# Altium schematic sheet 23.SchDoc
size 513 x 386 mm
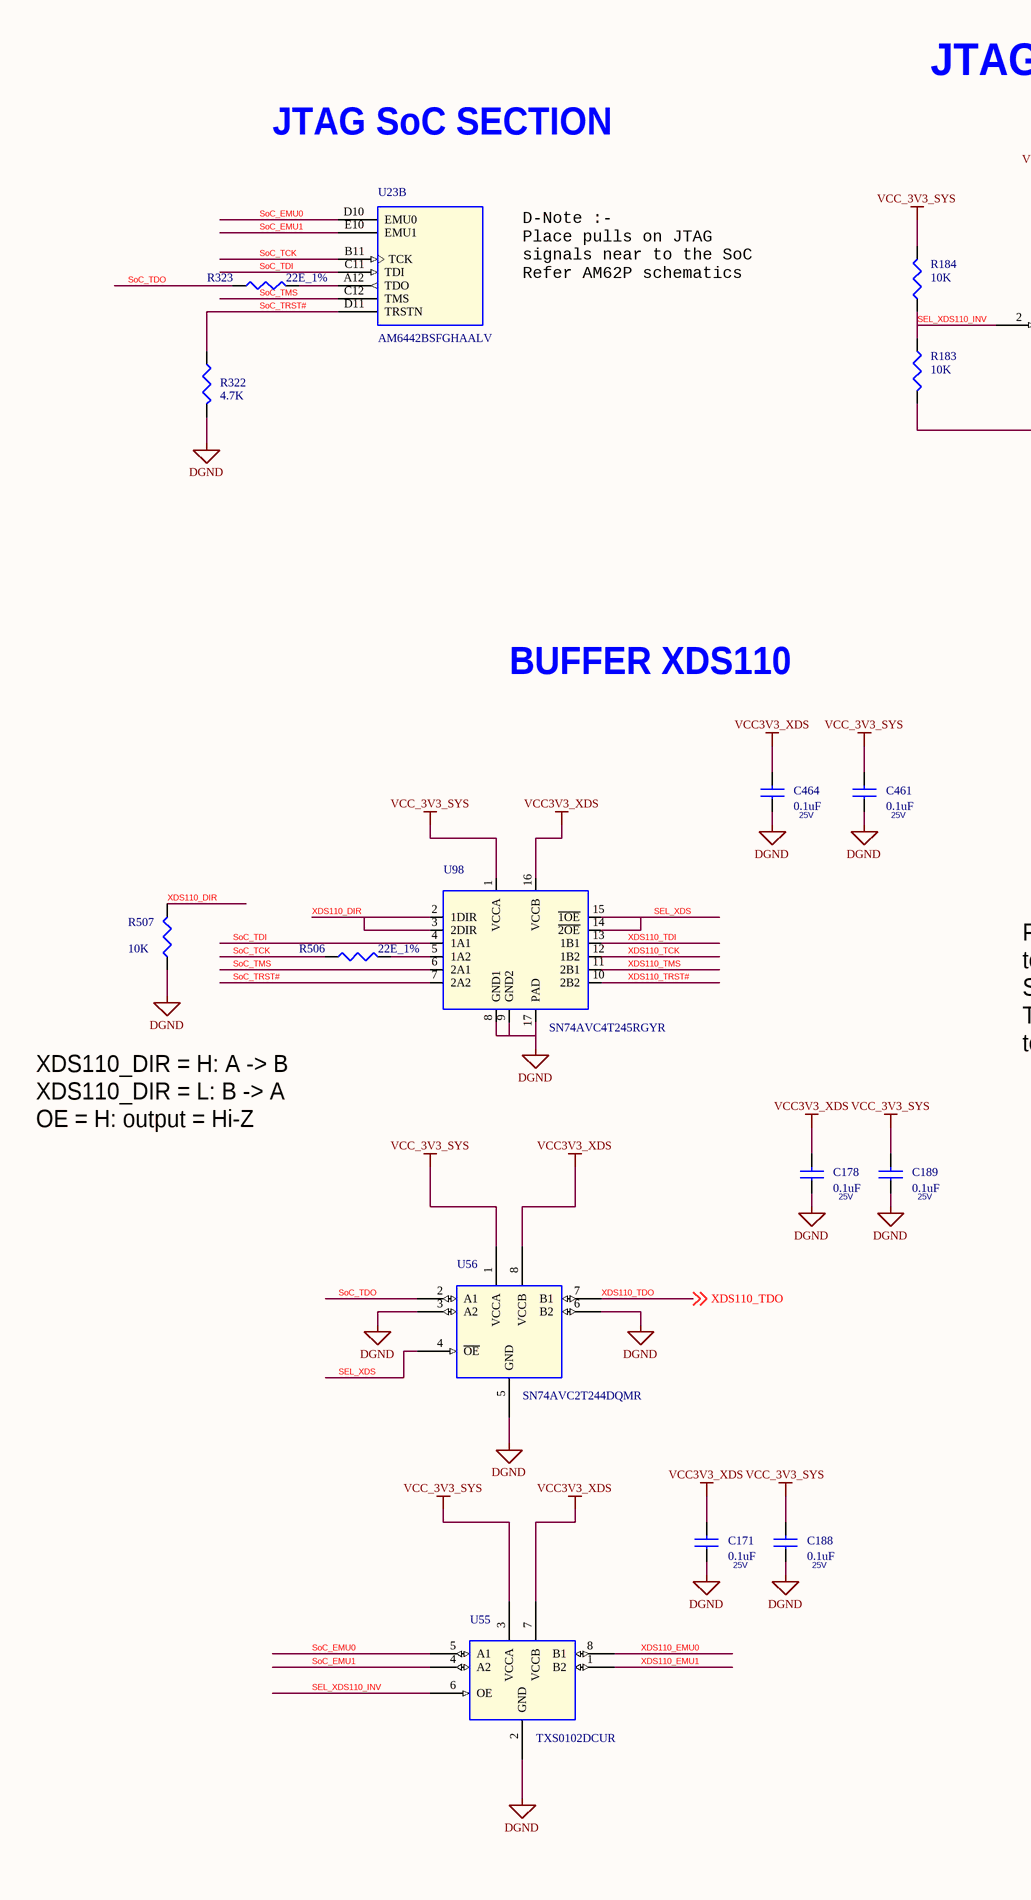
[diagram p0: 23.SchDoc, left]
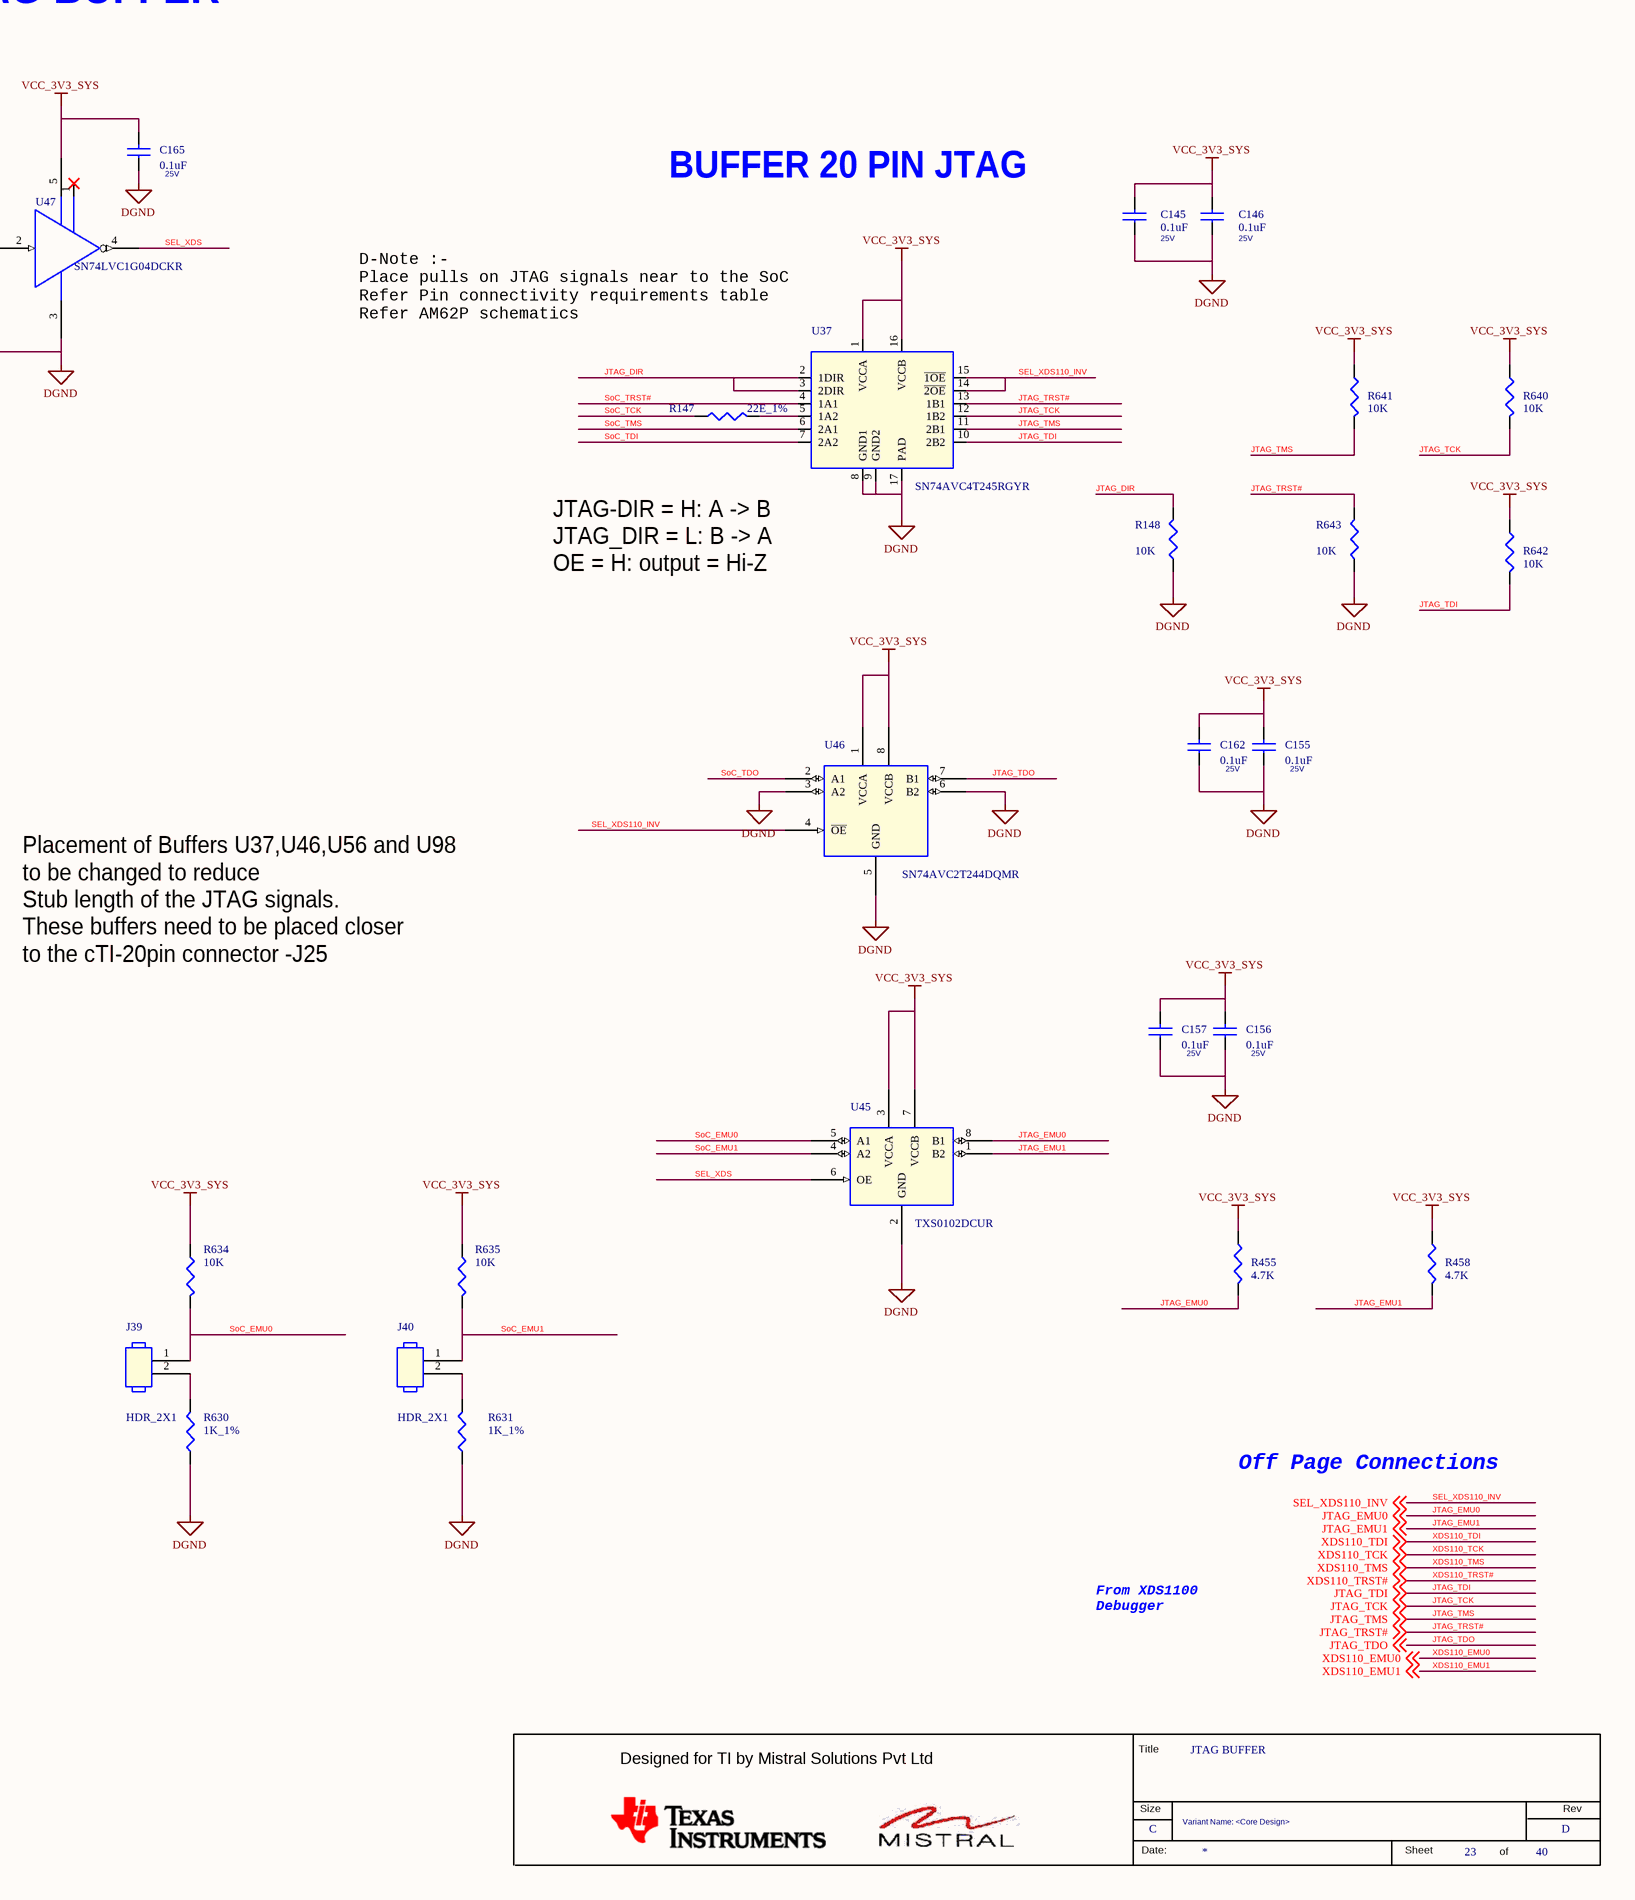
[diagram p1: 23.SchDoc, right]

## Parts
*  RevCode: D  Title: JTAG BUFFER  Page Size: C  Page Number: 23  Page Count: 40  Variant Name: <Core Design>  (hidden comment: MISTRAL_TITLEBLK_CSIZE)  (graphical)
C145  0.1uF  Voltage: 25V  [CAP0402_0-75]
C146  0.1uF  Voltage: 25V  [CAP0402_0-75]
C155  0.1uF  Voltage: 25V  [CAP0402_0-75]
C156  0.1uF  Voltage: 25V  [CAP0402_0-75]
C157  0.1uF  Voltage: 25V  [CAP0402_0-75]
C162  0.1uF  Voltage: 25V  [CAP0402_0-75]
C165  0.1uF  Voltage: 25V  [CAP0402_0-75]
C171  0.1uF  Voltage: 25V  [CAP0402_0-75]
C178  0.1uF  Voltage: 25V  [CAP0402_0-75]
C188  0.1uF  Voltage: 25V  [CAP0402_0-75]
C189  0.1uF  Voltage: 25V  [CAP0402_0-75]
C461  0.1uF  Voltage: 25V  [CAP0402_0-75]
C464  0.1uF  Voltage: 25V  [CAP0402_0-75]
J39  HDR_2X1  [HDR_2X1_100_S_T_10-8]
J40  HDR_2X1  [HDR_2X1_100_S_T_10-8]
R147  22E_1%  [RES0402_0-5]
R148  10K  [RES0402_0-5]
R183  10K  [RES0402_0-5]
R184  10K  [RES0402_0-5]
R322  4.7K  [RES0402_0-5]
R323  22E_1%  [RES0402_0-5]
R455  4.7K  [RES0402_0-5]
R458  4.7K  [RES0402_0-5]
R506  22E_1%  [RES0402_0-5]
R507  10K  [RES0402_0-5]
R630  1K_1%  [RES0402_0-5]
R631  1K_1%  [RES0402_0-5]
R634  10K  [RES0402_0-5]
R635  10K  [RES0402_0-5]
R640  10K  [RES0402_0-5]
R641  10K  [RES0402_0-5]
R642  10K  [RES0402_0-5]
R643  10K  [RES0402_0-5]
U23  AM6442BSFGHAALV  [FCBGA441_31-49_680X680_2-6]  (part B of 16)
U37  SN74AVC4T245RGYR  [QFN16_19-68_160X140]
U45  TXS0102DCUR  [VSSOP8_19-68_85X95_0-9]
U46  SN74AVC2T244DQMR  [X2SON8_15-74_70X50]
U47  SN74LVC1G04DCKR  [SC70-5]
U55  TXS0102DCUR  [VSSOP8_19-68_85X95_0-9]
U56  SN74AVC2T244DQMR  [X2SON8_15-74_70X50]
U98  SN74AVC4T245RGYR  [QFN16_19-68_160X140]

## Nets
DGND: C145.1 C146.1 C155.1 C156.1 C157.1 C162.1 C165.1 C171.1 C178.1 C188.1 C189.1 C461.1 C464.1 R148.1 R183.2 R322.2 R507.1 R630.1 R631.1 R643.1 U37.8(GND1) U37.9(GND2) U37.17(PAD) U45.2(GND) U46.3(A2) U46.5(GND) U46.6(B2) U47.3(GND) U55.2(GND) U56.3(A2) U56.5(GND) U56.6(B2) U98.8(GND1) U98.9(GND2) U98.17(PAD)
VCC3V3_XDS: C171.2 C178.2 C464.2 U55.7(VCCB) U56.8(VCCB) U98.16(VCCB)
VCC_3V3_SYS: C145.2 C146.2 C155.2 C156.2 C157.2 C162.2 C165.2 C188.2 C189.2 C461.2 R184.2 R455.1 R458.1 R634.1 R635.1 R640.1 R641.1 R642.1 U37.1(VCCA) U37.16(VCCB) U45.3(VCCA) U45.7(VCCB) U46.1(VCCA) U46.8(VCCB) U47.5(VCC) U55.3(VCCA) U56.1(VCCA) U98.1(VCCA)
JTAG_DIR: R148.2 U37.2(1DIR) U37.3(2DIR)
JTAG_EMU0: R455.2 U45.8(B1) ; off-sheet JTAG_EMU0
JTAG_EMU1: R458.2 U45.1(B2) ; off-sheet JTAG_EMU1
JTAG_TCK: R640.2 U37.12(1B2) ; off-sheet JTAG_TCK
JTAG_TDI: R642.2 U37.10(2B2) ; off-sheet JTAG_TDI
JTAG_TDO: U46.7(B1) ; off-sheet JTAG_TDO
JTAG_TMS: R641.2 U37.11(2B1) ; off-sheet JTAG_TMS
JTAG_TRST#: R643.2 U37.13(1B1) ; off-sheet JTAG_TRST#
SEL_XDS: U45.6(OE) U47.4(Y) U56.4(~{OE}) U98.14(~{2OE}) U98.15(~{1OE})
SEL_XDS110_INV: R183.1 R184.1 U37.14(~{2OE}) U37.15(~{1OE}) U46.4(~{OE}) U47.2(A) U55.6(OE) ; off-sheet SEL_XDS110_INV
SoC_EMU0: J39.1 R634.2 U23.D10(EMU0) U45.5(A1) U55.5(A1)
SoC_EMU1: J40.1 R635.2 U23.E10(EMU1) U45.4(A2) U55.4(A2)
SoC_TCK: R147.2 R506.2 U23.B11(TCK)
SoC_TDI: U23.C11(TDI) U37.7(2A2) U98.4(1A1)
SoC_TDO: R323.1 U46.2(A1) U56.2(A1)
SoC_TMS: U23.C12(TMS) U37.6(2A1) U98.6(2A1)
SoC_TRST#: R322.1 U23.D11(TRSTN) U37.4(1A1) U98.7(2A2)
XDS110_DIR: R507.2 U98.2(1DIR) U98.3(2DIR)
XDS110_EMU0: U55.8(B1) ; off-sheet XDS110_EMU0
XDS110_EMU1: U55.1(B2) ; off-sheet XDS110_EMU1
XDS110_TCK: U98.12(1B2) ; off-sheet XDS110_TCK
XDS110_TDI: U98.13(1B1) ; off-sheet XDS110_TDI
XDS110_TDO: U56.7(B1) ; off-sheet XDS110_TDO
XDS110_TMS: U98.11(2B1) ; off-sheet XDS110_TMS
XDS110_TRST#: U98.10(2B2) ; off-sheet XDS110_TRST#
NetJ39_2: J39.2 R630.2
NetJ40_2: J40.2 R631.2
NetR147_1: R147.1 U37.5(1A2)
NetR323_2: R323.2 U23.A12(TDO)
NetR506_1: R506.1 U98.5(1A2)

Not connected (* = marked no-connect by the designer): U47 1(NC)*

## Notes on the sheet
- JTAG BUFFER
- JTAG SoC SECTION
- D-Note :-
  Place pulls on JTAG
  signals near to the SoC
  Refer AM62P schematics
- BUFFER 20 PIN JTAG
- (near U37) D-Note :-
  Place pulls on JTAG signals near to the SoC
  Refer Pin connectivity requirements table
  Refer AM62P schematics
- (near U37) JTAG-DIR = H: A -> B
  JTAG_DIR = L: B -> A
  OE = H: output = Hi-Z
- BUFFER XDS110
- Placement of Buffers U37,U46,U56 and U98
  to be changed to reduce
  Stub length of the JTAG signals.
  These buffers need to be placed closer
  to the cTI-20pin connector -J25
- XDS110_DIR = H: A -> B
  XDS110_DIR = L: B -> A
  OE = H: output = Hi-Z
- Off Page Connections
- From XDS1100
  Debugger
- (in symbol MISTRAL_TITLEBLK_CSIZE) Title; Designed for TI by Mistral Solutions Pvt Ltd; Size; Rev; Date:; Sheet; of

## Library data of the parts
* = MISTRAL_TITLEBLK_CSIZE: Issue: 1.0; Page Create Date: March  8, 1995; Page Modify Date: *
C145 C146 C155 C156 C171 C178 C188 C189 C461 C464 = CAP_Dup3: CAP CERAMIC 0.1uF 25V 20% X5R 0402; Alt_Mfr_part_number: CC0402KRX5R8BB104; Mistral Part No: 120020080003-R; Mfr_name: WURTH ELECTRONICS; Mfr_part_number: 885012105018; Part_type: CAPACITORS\CERAMIC; Alt_Mfr_name: YAGEO AMERICA; Project: AM64x_EVM_BRD; Wattage: NA; Customs_HS_Code: 85322990; Custom_Duty: 15%; Tolerance: 20%; Package: 0402; Distributor_name: DIGIKEY; Distributor_part_number: 732-7495-1-ND; Height: 0.55MM; Weight: 0.65mg; Temperature: -55癈+85癈; Datasheet: Y:\MIS_DATABASE\DATASHEETS\CAPACITORS\885012105018.PDF; Crtd /date: ALVY/170820; Chkd/date: MANIRAJA/170820; MECHANICAL 3D STEP FILE: CAP0402_0-75; Library Ref: CAP; Footprint Ref: CAP0402_0-75; Library Path: Y:\MIS_DATABASE\Library\ALTIUM_TOOL\SCHEMATICS_PARTS\MS_DISCRETE_Library.schlib; Footprint Path: Y:\MIS_DATABASE\Library\ALTIUM_TOOL\PCB_FOOTPRINTS\Altium_Footprint_Lib.PcbLib; PCB Footprint: CAP0402_0-75
C157 C162 C165 = CAP_Dup3: CAP CERAMIC 0.1uF 25V 20% X5R 0402; Alt_Mfr_name: YAGEO AMERICA; Part_type: CAPACITORS\CERAMIC; Mfr_part_number: 885012105018; Mfr_name: WURTH ELECTRONICS; Mistral Part No: 120020080003-R; Alt_Mfr_part_number: CC0402KRX5R8BB104; Custom_Duty: 15%; Customs_HS_Code: 85322990; Wattage: NA; Project: AM64x_EVM_BRD; Footprint Path: Y:\MIS_DATABASE\Library\ALTIUM_TOOL\PCB_FOOTPRINTS\Altium_Footprint_Lib.PcbLib; Library Path: Y:\MIS_DATABASE\Library\ALTIUM_TOOL\SCHEMATICS_PARTS\MS_DISCRETE_Library.schlib; Footprint Ref: CAP0402_0-75; Library Ref: CAP; MECHANICAL 3D STEP FILE: CAP0402_0-75; Chkd/date: MANIRAJA/170820; Crtd /date: ALVY/170820; Datasheet: Y:\MIS_DATABASE\DATASHEETS\CAPACITORS\885012105018.PDF; Temperature: -55癈+85癈; Weight: 0.65mg; Height: 0.55MM; Distributor_part_number: 732-7495-1-ND; Distributor_name: DIGIKEY; Package: 0402; Tolerance: 20%; PCB Footprint: CAP0402_0-75
J39 J40 = HEADER_2X1_Dup1: CON HDR 2X1 2.54MM PITCH ST TH; Mistral Part No: 150009030246-R; Mfr_name: MOLEX; Part_type: CONNECTOR\HEADERS; Wattage: NA; Project: FPGA EXTENDER CARD; Customs_HS_Code: 85369090; Custom_Duty: 24%; PCB Footprint: HDR_2X1_100_S_T_10-8; Footprint Ref: HDR_2X1_100_S_T_10-8; Library Ref: HEADER_2X1; Footprint Path: Y:\MIS_DATABASE\Library\ALTIUM_TOOL\PCB_FOOTPRINTS\Altium_Footprint_Lib.PcbLib; Library Path: Y:\MIS_DATABASE\Library\ALTIUM_TOOL\SCHEMATICS_PARTS\MS_Connector_Library.schlib; MECHANICAL 3D STEP FILE: HDR_2X1_100_S_T_10-8; Temperature: -0癈+75癈; Weight: 139gm; Voltage: NA; Tolerance: NA; Mfr_part_number: 22-03-2021; Package: THRU-HOLE; Distributor_name: DIGIKEY; Distributor_part_number: WM4000-ND; Height: 10.79MM; Datasheet: Y:\MIS_DATABASE\DATASHEETS\CONNECTORS\HEADER_X4030.PDF; Crtd /date: MAZHAR/280405; Chkd/date: VASANTHA/060117
R147 R323 = RESISTOR_Dup5: RES 22E 1/16W 1% 0402; Mistral Part No: 110009090004-R; Mfr_name: YAGEO AMERICA; Mfr_part_number: RC0402FR-0722RL; Part_type: RESISTORS\FIXED; Cust_part_number: 4700-80047E; SIGNAL_MODEL: RESISTOR_RES0402_22E_22E; Project: VMEFMCD; Voltage: NA; Customs_HS_Code: 85332119; Custom_Duty: 15%; Library Ref: RESISTOR; Tolerance: 1%; Wattage: 1/16W; Package: 0402; Distributor_name: DIGIKEY; Distributor_part_number: 311-22.0LRCT-ND; Height: 0.40MM; Weight: 0.65mg; Temperature: -55癈+155癈; Datasheet: Y:\MIS_DATABASE\DATASHEETS\RESISTORS\RCXXXXL-SER_MAR18.PDF; Crtd /date: MAZHAR/090909; Chkd/date: SUHAS/290910; Footprint Ref: RES0402_0-5; PCB Footprint: RES0402_0-5; MECHANICAL 3D STEP FILE: RES0402_0-5; Library Path: Y:\MIS_DATABASE\Library\ALTIUM_TOOL\SCHEMATICS_PARTS\MS_DISCRETE_Library.schlib; Footprint Path: Y:\MIS_DATABASE\Library\ALTIUM_TOOL\PCB_FOOTPRINTS\Altium_Footprint_Lib.PcbLib
R148 R183 R507 R634 R635 R640 = RESISTOR_Dup6: RES 10K 1/16W 5% 0402; Mistral Part No: 110011060021-R; Mfr_name: YAGEO AMERICA; Mfr_part_number: RC0402JR-0710KL; Part_type: RESISTORS\FIXED; Project: HSE; Voltage: NA; Customs_HS_Code: 85332119; Custom_Duty: 15%; Footprint Path: Y:\MIS_DATABASE\Library\ALTIUM_TOOL\PCB_FOOTPRINTS\Altium_Footprint_Lib.PcbLib; Library Path: Y:\MIS_DATABASE\Library\ALTIUM_TOOL\SCHEMATICS_PARTS\MS_DISCRETE_Library.schlib; Footprint Ref: RES0402_0-5; Library Ref: RESISTOR; Tolerance: 5%; Wattage: 1/16W; Package: 0402; Distributor_name: DIGIKEY; Distributor_part_number: 311-10KJRCT-ND; Height: 0.40MM; Weight: 0.65mg; Temperature: -55癈+155癈; Datasheet: Y:\MIS_DATABASE\DATASHEETS\RESISTORS\RCXXXXL-SER_MAR18.PDF; Crtd /date: MAZHAR/230805; Chkd/date: VASANTHA/061216; MECHANICAL 3D STEP FILE: RES0402_0-5; PCB Footprint: RES0402_0-5
R184 R641-R643 = RESISTOR_Dup6: RES 10K 1/16W 5% 0402; Part_type: RESISTORS\FIXED; Mfr_part_number: RC0402JR-0710KL; Mfr_name: YAGEO AMERICA; Mistral Part No: 110011060021-R; Custom_Duty: 15%; Customs_HS_Code: 85332119; Voltage: NA; Project: HSE; PCB Footprint: RES0402_0-5; MECHANICAL 3D STEP FILE: RES0402_0-5; Chkd/date: VASANTHA/061216; Crtd /date: MAZHAR/230805; Datasheet: Y:\MIS_DATABASE\DATASHEETS\RESISTORS\RCXXXXL-SER_MAR18.PDF; Temperature: -55癈+155癈; Weight: 0.65mg; Height: 0.40MM; Distributor_part_number: 311-10KJRCT-ND; Distributor_name: DIGIKEY; Package: 0402; Wattage: 1/16W; Tolerance: 5%; Library Ref: RESISTOR; Footprint Ref: RES0402_0-5; Library Path: Y:\MIS_DATABASE\Library\ALTIUM_TOOL\SCHEMATICS_PARTS\MS_DISCRETE_Library.schlib; Footprint Path: Y:\MIS_DATABASE\Library\ALTIUM_TOOL\PCB_FOOTPRINTS\Altium_Footprint_Lib.PcbLib
R322 = RESISTOR_Dup4: RES 4.7K 1/16W 5% 0402; Mistral Part No: 110011060001-R; Mfr_name: YAGEO AMERICA; Mfr_part_number: RC0402JR-074K7L; Part_type: RESISTORS\FIXED; Project: TMDXCSK368; Voltage: NA; Customs_HS_Code: 85332119; Custom_Duty: 15%; Tolerance: 5%; Wattage: 1/16W; Package: 0402; Distributor_name: DIGIKEY; Distributor_part_number: 311-4.7KJRCT-ND; Height: 0.40MM; Weight: 0.65mg; Temperature: -55癈+155癈; Datasheet: Y:\MIS_DATABASE\DATASHEETS\RESISTORS\RCXXXXL-SER_MAR18.PDF; Crtd /date: VASANTHA/130516; Chkd/date: VASANTHA/130516; Library Ref: RESISTOR; Footprint Ref: RES0402_0-5; PCB Footprint: RES0402_0-5; MECHANICAL 3D STEP FILE: RES0402_0-5; Library Path: Y:\MIS_DATABASE\Library\ALTIUM_TOOL\SCHEMATICS_PARTS\MS_DISCRETE_Library.schlib; Footprint Path: Y:\MIS_DATABASE\Library\ALTIUM_TOOL\PCB_FOOTPRINTS\Altium_Footprint_Lib.PcbLib
R455 R458 = RESISTOR_Dup4: RES 4.7K 1/16W 5% 0402; Part_type: RESISTORS\FIXED; Mfr_part_number: RC0402JR-074K7L; Mfr_name: YAGEO AMERICA; Mistral Part No: 110011060001-R; Custom_Duty: 15%; Customs_HS_Code: 85332119; Voltage: NA; Project: TMDXCSK368; PCB Footprint: RES0402_0-5; Library Ref: RESISTOR; Chkd/date: VASANTHA/130516; Crtd /date: VASANTHA/130516; Datasheet: Y:\MIS_DATABASE\DATASHEETS\RESISTORS\RCXXXXL-SER_MAR18.PDF; Temperature: -55癈+155癈; Weight: 0.65mg; Height: 0.40MM; Distributor_part_number: 311-4.7KJRCT-ND; Distributor_name: DIGIKEY; Package: 0402; Wattage: 1/16W; Tolerance: 5%; Footprint Ref: RES0402_0-5; MECHANICAL 3D STEP FILE: RES0402_0-5; Library Path: Y:\MIS_DATABASE\Library\ALTIUM_TOOL\SCHEMATICS_PARTS\MS_DISCRETE_Library.schlib; Footprint Path: Y:\MIS_DATABASE\Library\ALTIUM_TOOL\PCB_FOOTPRINTS\Altium_Footprint_Lib.PcbLib
R506 = RESISTOR_Dup5: RES 22E 1/16W 1% 0402; Cust_part_number: 4700-80047E; Part_type: RESISTORS\FIXED; Mfr_part_number: RC0402FR-0722RL; Mfr_name: YAGEO AMERICA; Mistral Part No: 110009090004-R; Custom_Duty: 15%; Customs_HS_Code: 85332119; Voltage: NA; Project: VMEFMCD; SIGNAL_MODEL: RESISTOR_RES0402_22E_22E; Library Ref: RESISTOR; Chkd/date: SUHAS/290910; Crtd /date: MAZHAR/090909; Datasheet: Y:\MIS_DATABASE\DATASHEETS\RESISTORS\RCXXXXL-SER_MAR18.PDF; Temperature: -55癈+155癈; Weight: 0.65mg; Height: 0.40MM; Distributor_part_number: 311-22.0LRCT-ND; Distributor_name: DIGIKEY; Package: 0402; Wattage: 1/16W; Tolerance: 1%; Footprint Ref: RES0402_0-5; PCB Footprint: RES0402_0-5; MECHANICAL 3D STEP FILE: RES0402_0-5; Library Path: Y:\MIS_DATABASE\Library\ALTIUM_TOOL\SCHEMATICS_PARTS\MS_DISCRETE_Library.schlib; Footprint Path: Y:\MIS_DATABASE\Library\ALTIUM_TOOL\PCB_FOOTPRINTS\Altium_Footprint_Lib.PcbLib
R630 R631 = RESISTOR_Dup5: RES 1K 1/10W 1% 0402; Mistral Part No: 110009030411-R; Mfr_name: PANASONIC-ECG; Mfr_part_number: ERJ-2RKF1001X; Part_type: RESISTORS\FIXED; Project: VOCERA; Voltage: NA; Customs_HS_Code: 85332119; Custom_Duty: 15%; PCB Footprint: RES0402_0-5; Footprint Path: Y:\MIS_DATABASE\Library\ALTIUM_TOOL\PCB_FOOTPRINTS\Altium_Footprint_Lib.PcbLib; Library Path: Y:\MIS_DATABASE\Library\ALTIUM_TOOL\SCHEMATICS_PARTS\MS_DISCRETE_Library.schlib; MECHANICAL 3D STEP FILE: RES0402_0-5; Footprint Ref: RES0402_0-5; Library Ref: RESISTOR; Tolerance: 1%; Wattage: 1/10W; Package: 0402; Distributor_name: DIGIKEY; Distributor_part_number: P1.00KLCT-ND; Height: 0.40MM; Weight: 0.8mg; Temperature: -55癈+155癈; Datasheet: Y:\MIS_DATABASE\DATASHEETS\RESISTORS\PAN-ERJSER_NOV17.PDF; Crtd /date: MAZHAR/150506; Chkd/date: VASANTHA/281216
U23 = XAM6442BSFGGAALV_BGA441: IC AM64x SoC MICROPROCESSOR BGA441; Mistral Part No: 141220080002; Mfr_name: TEXAS INSTRUMENTS; Part_type: ICS\DIGITAL\MICROPROCESSOR; Project: AM64x-GP_EVM BRD; Tolerance: NA; Customs_HS_Code: 85423100; Custom_Duty: 15%; PCB Footprint: FCBGA441_31-49_680X680_2-6; Footprint Ref: FCBGA441_31-49_680X680_2-6; Mfr_part_number: AM6442BSFGHAALV; Voltage: NA; Wattage: NA; Package: BGA441; Distributor_name: NA; Distributor_part_number: NA; Library Ref: XAM6442BSFGGAALV_BGA441; Height: 2.57MM; Weight: NA; Temperature: NA; Datasheet: Y:\MIS_DATABASE\DATASHEETS\ICS\DIGITAL\MICROCONTROLLER\AM64-SoC_SVB.PDF; Crtd /date: ALVY/300322; Chkd/date: ALVY/300322; RoHS: NA; MECHANICAL 3D STEP FILE: FCBGA441_31-49_680X680_2-6; Library Path: Y:\MIS_DATABASE\Library\ALTIUM_TOOL\SCHEMATICS_PARTS\MS_MICROPROCESSOR_Library.schlib; Footprint Path: Y:\MIS_DATABASE\Library\ALTIUM_TOOL\PCB_FOOTPRINTS\Altium_Footprint_Lib.PcbLib
U37 = SN74AVC4T245RGYR_QFN16: IC 4-BIT DUAL SUPPLY BUS TRANSCEIVER QFN16; Mistral Part No: 141009030112-R; Mfr_name: TEXAS INSTRUMENTS; Part_type: ICS\DIGITAL\COMBINATIONAL; Project: HS100RD; Customs_HS_Code: 85423100; Custom_Duty: 15%; PCB Footprint: QFN16_19-68_160X140; Mfr_part_number: SN74AVC4T245RGYR; Package: QFN16; Distributor_name: DIGIKEY; Distributor_part_number: 296-18231-1-ND; Height: 1.00MM; Datasheet: Y:\MIS_DATABASE\DATASHEETS\ICS\DIGITAL\BUSTRANSCEIVER\SN74AVC4T245XXXX.PDF; Crtd /date: USMAN/060308; Chkd/date: MAZHAR/060308; RoHS: Sb/ Br FREE; Library Ref: SN74AVC4T245RGYR_QFN16
U45 = TXS0102DCUR_VSSOP8: IC 2BIT BI-DIR VOLTAGE-LEVEL TRANSLATOR US8(VSSOP8); Mistral Part No: 141009030376-R; Mfr_name: TEXAS INSTRUMENTS; Part_type: ICS\INTERFACE\LEVEL TRANSLATOR; Project: SD_WATERLOO; Tolerance: NA; Customs_HS_Code: 85423100; Custom_Duty: 15%; PCB Footprint: VSSOP8_19-68_85X95_0-9; Mfr_part_number: TXS0102DCUR; Voltage: NA; Wattage: NA; Package: US8; Distributor_name: DIGIKEY; Distributor_part_number: 296-21931-1-ND; Height: 0.90MM; Weight: 9.6mg; Temperature: -40癈+85癈; Datasheet: Y:\MIS_DATABASE\DATASHEETS\ICS\INTERFACE\TXS0102.PDF; Crtd /date: SHREESHAIL/190108; Chkd/date: MANIRAJA/130617; MECHANICAL 3D STEP FILE: VSSOP8_19-68_85X95_0-9; Library Path: Y:\MIS_DATABASE\Library\ALTIUM_TOOL\SCHEMATICS_PARTS\MS_MISCINTERFACE_Library.schlib; Footprint Path: Y:\MIS_DATABASE\Library\ALTIUM_TOOL\PCB_FOOTPRINTS\Altium_Footprint_Lib.PcbLib; Library Ref: TXS0102DCUR_VSSOP8; Footprint Ref: VSSOP8_19-68_85X95_0-9
U46 U56 = SN74AVC2T244DQMR_X2SON8: IC 2-BIT UNDIRECTIONAL VOLTAGE-LEVEL TRANSLATOR X2SON8; Part_type: ICS\INTERFACE\LEVEL TRANSLATOR; Mfr_name: TEXAS INSTRUMENTS; Mistral Part No: 141016030002-R; Customs_HS_Code: 15%; Pb-Free: 85423100; Wattage: NA; Project: OCTASIC_3600; PCB Footprint: X2SON8_15-74_70X50; Chkd/date: VASANTHA/060516; Crtd /date: VASANTHA/030316; Datasheet: Y:\MIS_DATABASE\DATASHEETS\ICS\INTERFACE\SN74AVC2T244.PDF; Temperature: -40癈+85癈; Weight: NA; Height: 0.40MM; Distributor_part_number: 296-29674-1-ND; Distributor_name: DIGIKEY; Package: X2SON8; Voltage: NA; Tolerance: NA; Mfr_part_number: SN74AVC2T244DQMR; Library Ref: SN74AVC2T244DQMR_X2SON8
U47 = SN74LVC1G04DCKR_SC70-5: IC SINGLE INVERTER GATE SC70-5; Mistral Part No: 141009070007-R; Mfr_name: TEXAS INSTRUMENTS; Part_type: ICS\DIGITAL\GATES; Project: BUG_BASE-II; Customs_HS_Code: 85423100; Custom_Duty: 15%; PCB Footprint: SC70-5; Library Ref: SN74LVC1G04DCKR_SC70-5; Mfr_part_number: SN74LVC1G04DCKR; Package: SC70-5; Distributor_name: DIGIKEY; Distributor_part_number: 296-11600-1-ND; Height: 1.10MM; Temperature: -40癈+85癈; Datasheet: Y:\MIS_DATABASE\DATASHEETS\ICS\DIGITAL\GATES\SN74LVC1G04-1.PDF; Crtd /date: USMAN/150709; Chkd/date: SUHAS/221010; RoHS: Sb/ Br FREE
U55 = TXS0102DCUR_VSSOP8: IC 2BIT BI-DIR VOLTAGE-LEVEL TRANSLATOR US8(VSSOP8); Part_type: ICS\INTERFACE\LEVEL TRANSLATOR; Mfr_name: TEXAS INSTRUMENTS; Mistral Part No: 141009030376-R; Custom_Duty: 15%; Customs_HS_Code: 85423100; Wattage: NA; Project: SD_WATERLOO; PCB Footprint: VSSOP8_19-68_85X95_0-9; Footprint Path: Y:\MIS_DATABASE\Library\ALTIUM_TOOL\PCB_FOOTPRINTS\Altium_Footprint_Lib.PcbLib; Library Path: Y:\MIS_DATABASE\Library\ALTIUM_TOOL\SCHEMATICS_PARTS\MS_MISCINTERFACE_Library.schlib; MECHANICAL 3D STEP FILE: VSSOP8_19-68_85X95_0-9; Chkd/date: MANIRAJA/130617; Crtd /date: SHREESHAIL/190108; Datasheet: Y:\MIS_DATABASE\DATASHEETS\ICS\INTERFACE\TXS0102.PDF; Temperature: -40癈+85癈; Weight: 9.6mg; Height: 0.90MM; Distributor_part_number: 296-21931-1-ND; Distributor_name: DIGIKEY; Package: US8; Voltage: NA; Tolerance: NA; Mfr_part_number: TXS0102DCUR; Library Ref: TXS0102DCUR_VSSOP8; Footprint Ref: VSSOP8_19-68_85X95_0-9
U98 = SN74AVC4T245RGYR_QFN16: IC 4-BIT DUAL SUPPLY BUS TRANSCEIVER QFN16; Part_type: ICS\DIGITAL\COMBINATIONAL; Mfr_name: TEXAS INSTRUMENTS; Mistral Part No: 141009030112-R; Custom_Duty: 15%; Customs_HS_Code: 85423100; Project: HS100RD; PCB Footprint: QFN16_19-68_160X140; RoHS: Sb/ Br FREE; Chkd/date: MAZHAR/060308; Crtd /date: USMAN/060308; Datasheet: Y:\MIS_DATABASE\DATASHEETS\ICS\DIGITAL\BUSTRANSCEIVER\SN74AVC4T245XXXX.PDF; Height: 1.00MM; Distributor_part_number: 296-18231-1-ND; Distributor_name: DIGIKEY; Package: QFN16; Mfr_part_number: SN74AVC4T245RGYR; Library Ref: SN74AVC4T245RGYR_QFN16